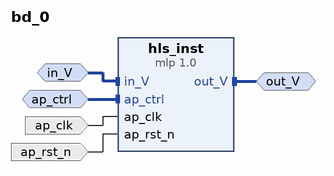
[diagram p0: block diagram of the top level]
# Vivado block design bd_0, xc7z020clg400-1, Vivado 2020.1
create_bd_design bd_0

create_bd_intf_port -mode Slave -vlnv xilinx.com:interface:acc_handshake_rtl:1.0 ap_ctrl
create_bd_intf_port -mode Slave -vlnv xilinx.com:interface:axis_rtl:1.0 in_V
set_property -dict [list \
  CONFIG.TDATA_NUM_BYTES 1 \
  CONFIG.TDEST_WIDTH 0 \
  CONFIG.TID_WIDTH 0 \
  CONFIG.TUSER_WIDTH 0 \
  CONFIG.HAS_TREADY 1 \
  CONFIG.HAS_TSTRB 0 \
  CONFIG.HAS_TKEEP 0 \
  CONFIG.HAS_TLAST 0 \
  CONFIG.FREQ_HZ 100000000.0 \
  CONFIG.LAYERED_METADATA undef \
] [get_bd_intf_ports in_V]
create_bd_intf_port -mode Master -vlnv xilinx.com:interface:axis_rtl:1.0 out_V
set_property -dict {CONFIG.FREQ_HZ 100000000.0} [get_bd_intf_ports out_V]
create_bd_port -dir I -type clk ap_clk
set_property -dict {CONFIG.FREQ_HZ 100000000.0} [get_bd_ports ap_clk]
create_bd_port -dir I -type rst ap_rst_n

create_bd_cell -type ip -vlnv xilinx.com:hls:mlp:1.0 hls_inst

# ---- connections ----

connect_bd_intf_net -intf_net in_V_0_1 [get_bd_intf_ports in_V] [get_bd_intf_pins hls_inst/in_V]
connect_bd_intf_net [get_bd_intf_ports out_V] [get_bd_intf_pins hls_inst/out_V]
connect_bd_intf_net -intf_net ap_ctrl_0_1 [get_bd_intf_ports ap_ctrl] [get_bd_intf_pins hls_inst/ap_ctrl]
connect_bd_net -net ap_clk_0_1 [get_bd_ports ap_clk] [get_bd_pins hls_inst/ap_clk]
connect_bd_net -net ap_rst_n_0_1 [get_bd_ports ap_rst_n] [get_bd_pins hls_inst/ap_rst_n]

validate_bd_design
save_bd_design
